# Altium schematic sheet FirsStageAmplifier.SchDoc
size A4; Author: Michał Kowalik; CompanyName: AGH; Engineer: dr inż. Piotr Otfinowski; Revision: 0.1; SheetNumber: 4; SheetTotal: 5; ProjectName: Project Name
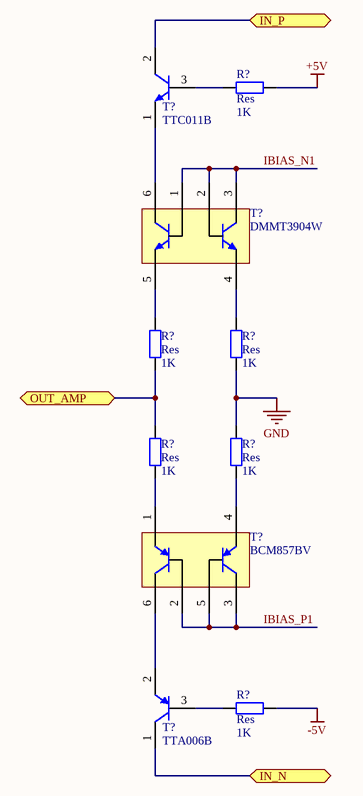
[diagram p0: FirsStageAmplifier.SchDoc]

## Parts
(Parts that share a designator on the sheet are numbered #1, #2 ... from top to bottom, then left to right.)
R?#1  Res  value 1K  [AXIAL-0.4]
R?#2  Res  value 1K  [AXIAL-0.4]
R?#3  Res  value 1K  [AXIAL-0.4]
R?#4  Res  value 1K  [AXIAL-0.4]
R?#5  Res  value 1K  [AXIAL-0.4]
R?#6  Res  value 1K  [AXIAL-0.4]
T?#1  TTC011B
T?#2  DMMT3904W
T?#3  BCM857BV
T?#4  TTA006B

## Ports
IN_N (bidir), IN_P (bidir), OUT_AMP (bidir)

## Nets
+5V: R?#1.2
-5V: R?#6.2
GND: R?#3.1 R?#5.2
IBIAS_N1: T?#2.1(B1) T?#2.2(B2) T?#2.3(C2)
IBIAS_P1: T?#3.2(B1) T?#3.3(E2) T?#3.5(B2)
IN_N: T?#4.1(E) ; port IN_N
IN_P: T?#1.2(B) ; port IN_P
OUT_AMP: R?#2.1 R?#4.2 ; port OUT_AMP
NetR?#1_1: R?#1.1 T?#1.3(C)
NetR?#2_2: R?#2.2 T?#2.5(E1)
NetR?#3_2: R?#3.2 T?#2.4(E2)
NetR?#4_1: R?#4.1 T?#3.1(C1)
NetR?#5_1: R?#5.1 T?#3.4(C2)
NetR?#6_1: R?#6.1 T?#4.3(C)
NetT?#1_1: T?#1.1(E) T?#2.6(C1)
NetT?#3_6: T?#3.6(E1) T?#4.2(B)

## Notes on the sheet
- Document name:
- Project name:
- Author:
- Date/Time:
- Sheet:
- Revision:
- of
- Designer:

## Library data of the parts
R?#1-R?#6 = Res: Resistor
T?#1 = TTC011B: NPN High Voltage Transistor; ComponentLink1Description: Manufacturer Link; ComponentLink1URL: http://www.fairchildsemi.com/; ComponentLink2Description: Datasheet; ComponentLink2URL: http://www.fairchildsemi.com/ds/2N%2F2N3904.pdf
T?#2 = DMMT3904W: 40V MATCHED PAIR NPN SMALL SIGNAL TRANSISTOR
T?#3 = BCM857BV: 40V MATCHED PAIR NPN SMALL SIGNAL TRANSISTOR
T?#4 = TTA006B: PNP High Voltage Transistor; ComponentLink1Description: Manufacturer Link; ComponentLink1URL: http://www.fairchildsemi.com/; ComponentLink2Description: Datasheet; ComponentLink2URL: http://www.fairchildsemi.com/ds/2N%2F2N3906.pdf